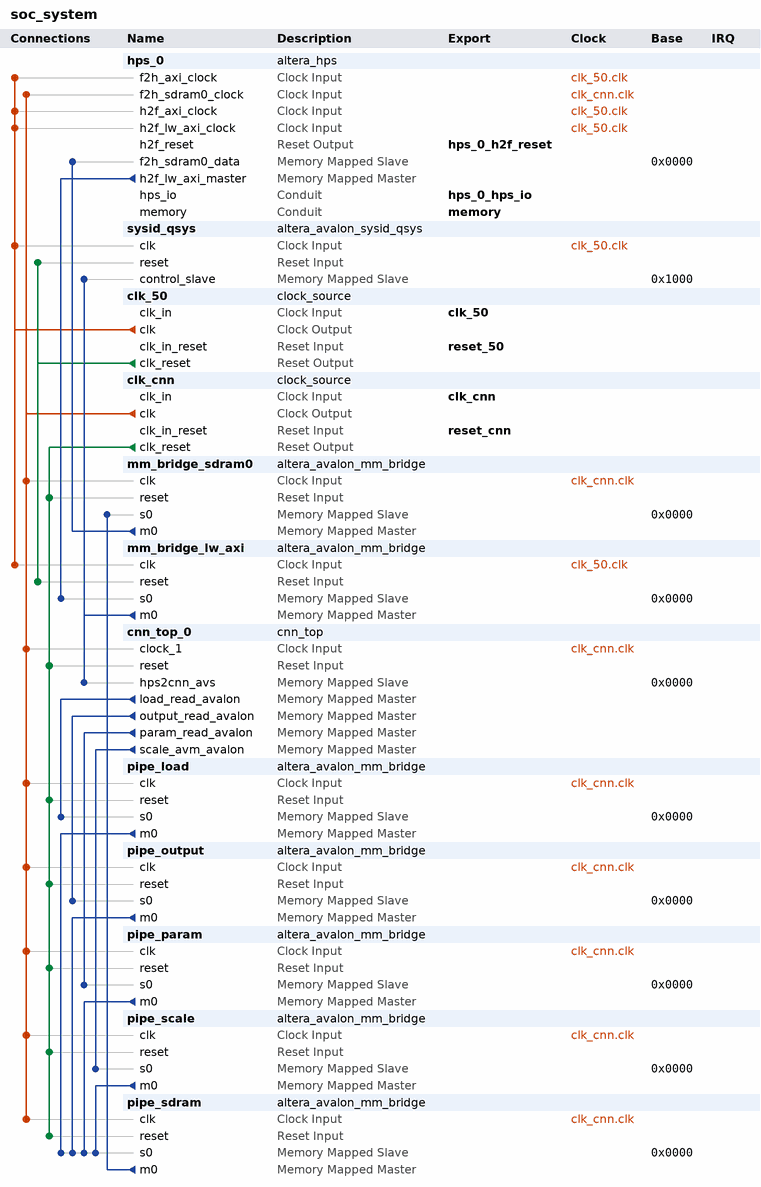
[diagram p0: system contents]
# Platform Designer (Qsys) system soc_system, Cyclone V 5CSEBA6U23I7
# Parameters at their usual value, and those the tool derives, are not listed.
package require -exact qsys 23.1
create_system soc_system
set_project_property DEVICE_FAMILY {Cyclone V}
set_project_property DEVICE 5CSEBA6U23I7

add_instance hps_0 altera_hps 23.1
set_instance_parameter_value hps_0 EMAC1_Mode RGMII
set_instance_parameter_value hps_0 EMAC1_PinMuxing {HPS I/O Set 0}
set_instance_parameter_value hps_0 F2SCLK_COLDRST_Enable false
set_instance_parameter_value hps_0 F2SCLK_DBGRST_Enable false
set_instance_parameter_value hps_0 F2SCLK_WARMRST_Enable false
set_instance_parameter_value hps_0 F2SDRAM_Type {Avalon-MM Bidirectional}
set_instance_parameter_value hps_0 F2SDRAM_Width 128
set_instance_parameter_value hps_0 F2SINTERRUPT_Enable true
set_instance_parameter_value hps_0 F2S_Width 3
set_instance_parameter_value hps_0 FPGA_PERIPHERAL_OUTPUT_CLOCK_FREQ_EMAC0_GTX_CLK 100
set_instance_parameter_value hps_0 FPGA_PERIPHERAL_OUTPUT_CLOCK_FREQ_EMAC0_MD_CLK 100.0
set_instance_parameter_value hps_0 FPGA_PERIPHERAL_OUTPUT_CLOCK_FREQ_EMAC1_GTX_CLK 100
set_instance_parameter_value hps_0 FPGA_PERIPHERAL_OUTPUT_CLOCK_FREQ_EMAC1_MD_CLK 100.0
set_instance_parameter_value hps_0 HPS_PROTOCOL DDR3
set_instance_parameter_value hps_0 I2C0_Mode N/A
set_instance_parameter_value hps_0 I2C0_PinMuxing Unused
set_instance_parameter_value hps_0 I2C1_Mode N/A
set_instance_parameter_value hps_0 I2C1_PinMuxing Unused
set_instance_parameter_value hps_0 LWH2F_Enable true
set_instance_parameter_value hps_0 MEM_BANKADDR_WIDTH 3
set_instance_parameter_value hps_0 MEM_CLK_FREQ 400.0
set_instance_parameter_value hps_0 MEM_COL_ADDR_WIDTH 10
set_instance_parameter_value hps_0 MEM_DQ_WIDTH 32
set_instance_parameter_value hps_0 MEM_DRV_STR RZQ/6
set_instance_parameter_value hps_0 MEM_ROW_ADDR_WIDTH 15
set_instance_parameter_value hps_0 MEM_RTT_NOM RZQ/6
set_instance_parameter_value hps_0 MEM_RTT_WR {Dynamic ODT off}
set_instance_parameter_value hps_0 MEM_TCL 11
set_instance_parameter_value hps_0 MEM_TFAW_NS 45.0
set_instance_parameter_value hps_0 MEM_TRAS_NS 35.0
set_instance_parameter_value hps_0 MEM_TRCD_NS 13.75
set_instance_parameter_value hps_0 MEM_TRFC_NS 260.0
set_instance_parameter_value hps_0 MEM_TRP_NS 13.75
set_instance_parameter_value hps_0 MEM_VENDOR Micron
set_instance_parameter_value hps_0 MEM_WTCL 7
set_instance_parameter_value hps_0 QSPI_Mode N/A
set_instance_parameter_value hps_0 QSPI_PinMuxing Unused
set_instance_parameter_value hps_0 REF_CLK_FREQ 25.0
set_instance_parameter_value hps_0 S2FCLK_USER2CLK 5
set_instance_parameter_value hps_0 S2F_Width 3
set_instance_parameter_value hps_0 SDIO_Mode {4-bit Data}
set_instance_parameter_value hps_0 SDIO_PinMuxing {HPS I/O Set 0}
set_instance_parameter_value hps_0 SPIM1_Mode N/A
set_instance_parameter_value hps_0 SPIM1_PinMuxing Unused
set_instance_parameter_value hps_0 STM_Enable false
set_instance_parameter_value hps_0 TIMING_BOARD_AC_SKEW 0.02
set_instance_parameter_value hps_0 TIMING_BOARD_AC_TO_CK_SKEW 0.01
set_instance_parameter_value hps_0 TIMING_BOARD_DQ_TO_DQS_SKEW 0.05
set_instance_parameter_value hps_0 TIMING_BOARD_MAX_CK_DELAY 0.03
set_instance_parameter_value hps_0 TIMING_BOARD_MAX_DQS_DELAY 0.02
set_instance_parameter_value hps_0 TIMING_BOARD_SKEW_BETWEEN_DQS 0.06
set_instance_parameter_value hps_0 TIMING_BOARD_SKEW_CKDQS_DIMM_MAX 0.12
set_instance_parameter_value hps_0 TIMING_BOARD_SKEW_CKDQS_DIMM_MIN 0.06
set_instance_parameter_value hps_0 TIMING_BOARD_SKEW_WITHIN_DQS 0.01
set_instance_parameter_value hps_0 TIMING_TDH 65
set_instance_parameter_value hps_0 TIMING_TDQSCK 255
set_instance_parameter_value hps_0 TIMING_TDQSQ 125
set_instance_parameter_value hps_0 TIMING_TDS 30
set_instance_parameter_value hps_0 TIMING_TIH 140
set_instance_parameter_value hps_0 TIMING_TIS 190
set_instance_parameter_value hps_0 TIMING_TQSH 0.4
set_instance_parameter_value hps_0 UART0_Mode {No Flow Control}
set_instance_parameter_value hps_0 UART0_PinMuxing {HPS I/O Set 0}
set_instance_parameter_value hps_0 USB1_Mode SDR
set_instance_parameter_value hps_0 USB1_PinMuxing {HPS I/O Set 0}
set_instance_parameter_value hps_0 desired_cfg_clk_mhz 100.0
set_instance_parameter_value hps_0 desired_qspi_clk_mhz 400.0

add_instance sysid_qsys altera_avalon_sysid_qsys 23.1
set_instance_parameter_value sysid_qsys id -1395322110

add_instance clk_50 clock_source 23.1
set_instance_parameter_value clk_50 clockFrequency 50000000

add_instance clk_cnn clock_source 23.1
set_instance_parameter_value clk_cnn clockFrequency 100000000

add_instance mm_bridge_sdram0 altera_avalon_mm_bridge 23.1
set_instance_parameter_value mm_bridge_sdram0 ADDRESS_UNITS SYMBOLS
set_instance_parameter_value mm_bridge_sdram0 ADDRESS_WIDTH 32
set_instance_parameter_value mm_bridge_sdram0 DATA_WIDTH 128
set_instance_parameter_value mm_bridge_sdram0 MAX_BURST_SIZE 16
set_instance_parameter_value mm_bridge_sdram0 MAX_PENDING_RESPONSES 4
set_instance_parameter_value mm_bridge_sdram0 USE_AUTO_ADDRESS_WIDTH 0

add_instance mm_bridge_lw_axi altera_avalon_mm_bridge 23.1
set_instance_parameter_value mm_bridge_lw_axi ADDRESS_UNITS SYMBOLS
set_instance_parameter_value mm_bridge_lw_axi ADDRESS_WIDTH 10
set_instance_parameter_value mm_bridge_lw_axi DATA_WIDTH 32
set_instance_parameter_value mm_bridge_lw_axi MAX_PENDING_RESPONSES 4
set_instance_parameter_value mm_bridge_lw_axi USE_AUTO_ADDRESS_WIDTH 1

add_instance cnn_top_0 cnn_top 2.0
set_instance_parameter_value cnn_top_0 CFG_M_AXI_ADDR_WIDTH 32
set_instance_parameter_value cnn_top_0 CFG_M_AXI_DATA_WIDTH 32
set_instance_parameter_value cnn_top_0 LOAD_M_AXI_ADDR_WIDTH 32
set_instance_parameter_value cnn_top_0 LOAD_M_AXI_DATA_WIDTH 64
set_instance_parameter_value cnn_top_0 OUTPUT_M_AXI_ADDR_WIDTH 32
set_instance_parameter_value cnn_top_0 OUTPUT_M_AXI_DATA_WIDTH 64
set_instance_parameter_value cnn_top_0 SCALE_M_AXI_ADDR_WIDTH 32
set_instance_parameter_value cnn_top_0 SCALE_M_AXI_DATA_WIDTH 32

add_instance pipe_load altera_avalon_mm_bridge 23.1
set_instance_parameter_value pipe_load ADDRESS_UNITS SYMBOLS
set_instance_parameter_value pipe_load ADDRESS_WIDTH 32
set_instance_parameter_value pipe_load DATA_WIDTH 64
set_instance_parameter_value pipe_load MAX_BURST_SIZE 16
set_instance_parameter_value pipe_load MAX_PENDING_RESPONSES 4
set_instance_parameter_value pipe_load USE_AUTO_ADDRESS_WIDTH 0

add_instance pipe_output altera_avalon_mm_bridge 23.1
set_instance_parameter_value pipe_output ADDRESS_UNITS SYMBOLS
set_instance_parameter_value pipe_output ADDRESS_WIDTH 32
set_instance_parameter_value pipe_output DATA_WIDTH 64
set_instance_parameter_value pipe_output MAX_BURST_SIZE 16
set_instance_parameter_value pipe_output MAX_PENDING_RESPONSES 4
set_instance_parameter_value pipe_output USE_AUTO_ADDRESS_WIDTH 0

add_instance pipe_param altera_avalon_mm_bridge 23.1
set_instance_parameter_value pipe_param ADDRESS_UNITS SYMBOLS
set_instance_parameter_value pipe_param ADDRESS_WIDTH 32
set_instance_parameter_value pipe_param DATA_WIDTH 32
set_instance_parameter_value pipe_param MAX_BURST_SIZE 16
set_instance_parameter_value pipe_param MAX_PENDING_RESPONSES 4
set_instance_parameter_value pipe_param USE_AUTO_ADDRESS_WIDTH 0

add_instance pipe_scale altera_avalon_mm_bridge 23.1
set_instance_parameter_value pipe_scale ADDRESS_UNITS SYMBOLS
set_instance_parameter_value pipe_scale ADDRESS_WIDTH 32
set_instance_parameter_value pipe_scale DATA_WIDTH 32
set_instance_parameter_value pipe_scale MAX_BURST_SIZE 16
set_instance_parameter_value pipe_scale MAX_PENDING_RESPONSES 4
set_instance_parameter_value pipe_scale USE_AUTO_ADDRESS_WIDTH 0

add_instance pipe_sdram altera_avalon_mm_bridge 23.1
set_instance_parameter_value pipe_sdram ADDRESS_UNITS SYMBOLS
set_instance_parameter_value pipe_sdram ADDRESS_WIDTH 32
set_instance_parameter_value pipe_sdram DATA_WIDTH 128
set_instance_parameter_value pipe_sdram MAX_BURST_SIZE 16
set_instance_parameter_value pipe_sdram MAX_PENDING_RESPONSES 4
set_instance_parameter_value pipe_sdram USE_AUTO_ADDRESS_WIDTH 0

# connections
add_connection clk_50.clk hps_0.f2h_axi_clock clock
add_connection clk_50.clk hps_0.h2f_axi_clock clock
add_connection clk_50.clk hps_0.h2f_lw_axi_clock clock
add_connection clk_50.clk mm_bridge_lw_axi.clk clock
add_connection clk_50.clk sysid_qsys.clk clock
add_connection clk_cnn.clk cnn_top_0.clock_1 clock
add_connection clk_cnn.clk hps_0.f2h_sdram0_clock clock
add_connection clk_cnn.clk mm_bridge_sdram0.clk clock
add_connection clk_cnn.clk pipe_load.clk clock
add_connection clk_cnn.clk pipe_output.clk clock
add_connection clk_cnn.clk pipe_param.clk clock
add_connection clk_cnn.clk pipe_scale.clk clock
add_connection clk_cnn.clk pipe_sdram.clk clock
add_connection clk_50.clk_reset mm_bridge_lw_axi.reset reset
add_connection clk_50.clk_reset sysid_qsys.reset reset
add_connection clk_cnn.clk_reset cnn_top_0.reset reset
add_connection clk_cnn.clk_reset mm_bridge_sdram0.reset reset
add_connection clk_cnn.clk_reset pipe_load.reset reset
add_connection clk_cnn.clk_reset pipe_output.reset reset
add_connection clk_cnn.clk_reset pipe_param.reset reset
add_connection clk_cnn.clk_reset pipe_scale.reset reset
add_connection clk_cnn.clk_reset pipe_sdram.reset reset
add_connection cnn_top_0.load_read_avalon pipe_load.s0 avalon
set_connection_parameter_value cnn_top_0.load_read_avalon/pipe_load.s0 baseAddress 0x0000
add_connection cnn_top_0.output_read_avalon pipe_output.s0 avalon
set_connection_parameter_value cnn_top_0.output_read_avalon/pipe_output.s0 baseAddress 0x0000
add_connection cnn_top_0.param_read_avalon pipe_param.s0 avalon
set_connection_parameter_value cnn_top_0.param_read_avalon/pipe_param.s0 baseAddress 0x0000
add_connection cnn_top_0.scale_avm_avalon pipe_scale.s0 avalon
set_connection_parameter_value cnn_top_0.scale_avm_avalon/pipe_scale.s0 baseAddress 0x0000
add_connection hps_0.h2f_lw_axi_master mm_bridge_lw_axi.s0 avalon
set_connection_parameter_value hps_0.h2f_lw_axi_master/mm_bridge_lw_axi.s0 baseAddress 0x0000
add_connection mm_bridge_lw_axi.m0 cnn_top_0.hps2cnn_avs avalon
set_connection_parameter_value mm_bridge_lw_axi.m0/cnn_top_0.hps2cnn_avs baseAddress 0x0000
add_connection mm_bridge_lw_axi.m0 sysid_qsys.control_slave avalon
set_connection_parameter_value mm_bridge_lw_axi.m0/sysid_qsys.control_slave baseAddress 0x1000
add_connection mm_bridge_sdram0.m0 hps_0.f2h_sdram0_data avalon
set_connection_parameter_value mm_bridge_sdram0.m0/hps_0.f2h_sdram0_data baseAddress 0x0000
add_connection pipe_load.m0 pipe_sdram.s0 avalon
set_connection_parameter_value pipe_load.m0/pipe_sdram.s0 baseAddress 0x0000
add_connection pipe_output.m0 pipe_sdram.s0 avalon
set_connection_parameter_value pipe_output.m0/pipe_sdram.s0 baseAddress 0x0000
add_connection pipe_param.m0 pipe_sdram.s0 avalon
set_connection_parameter_value pipe_param.m0/pipe_sdram.s0 baseAddress 0x0000
add_connection pipe_scale.m0 pipe_sdram.s0 avalon
set_connection_parameter_value pipe_scale.m0/pipe_sdram.s0 baseAddress 0x0000
add_connection pipe_sdram.m0 mm_bridge_sdram0.s0 avalon
set_connection_parameter_value pipe_sdram.m0/mm_bridge_sdram0.s0 baseAddress 0x0000

# exported interfaces
add_interface clk_50 clock sink
set_interface_property clk_50 EXPORT_OF clk_50.clk_in
add_interface clk_cnn clock sink
set_interface_property clk_cnn EXPORT_OF clk_cnn.clk_in
add_interface hps_0_h2f_reset reset source
set_interface_property hps_0_h2f_reset EXPORT_OF hps_0.h2f_reset
add_interface hps_0_hps_io conduit end
set_interface_property hps_0_hps_io EXPORT_OF hps_0.hps_io
add_interface memory conduit end
set_interface_property memory EXPORT_OF hps_0.memory
add_interface reset_50 reset sink
set_interface_property reset_50 EXPORT_OF clk_50.clk_in_reset
add_interface reset_cnn reset sink
set_interface_property reset_cnn EXPORT_OF clk_cnn.clk_in_reset

set_interconnect_requirement {$system} qsys_mm.clockCrossingAdapter HANDSHAKE
set_interconnect_requirement {$system} qsys_mm.maxAdditionalLatency 1

save_system soc_system.qsys
